# EAGLE design ReSpeaker 2-Mics Pi HAT (EAGLE 8.1.0)
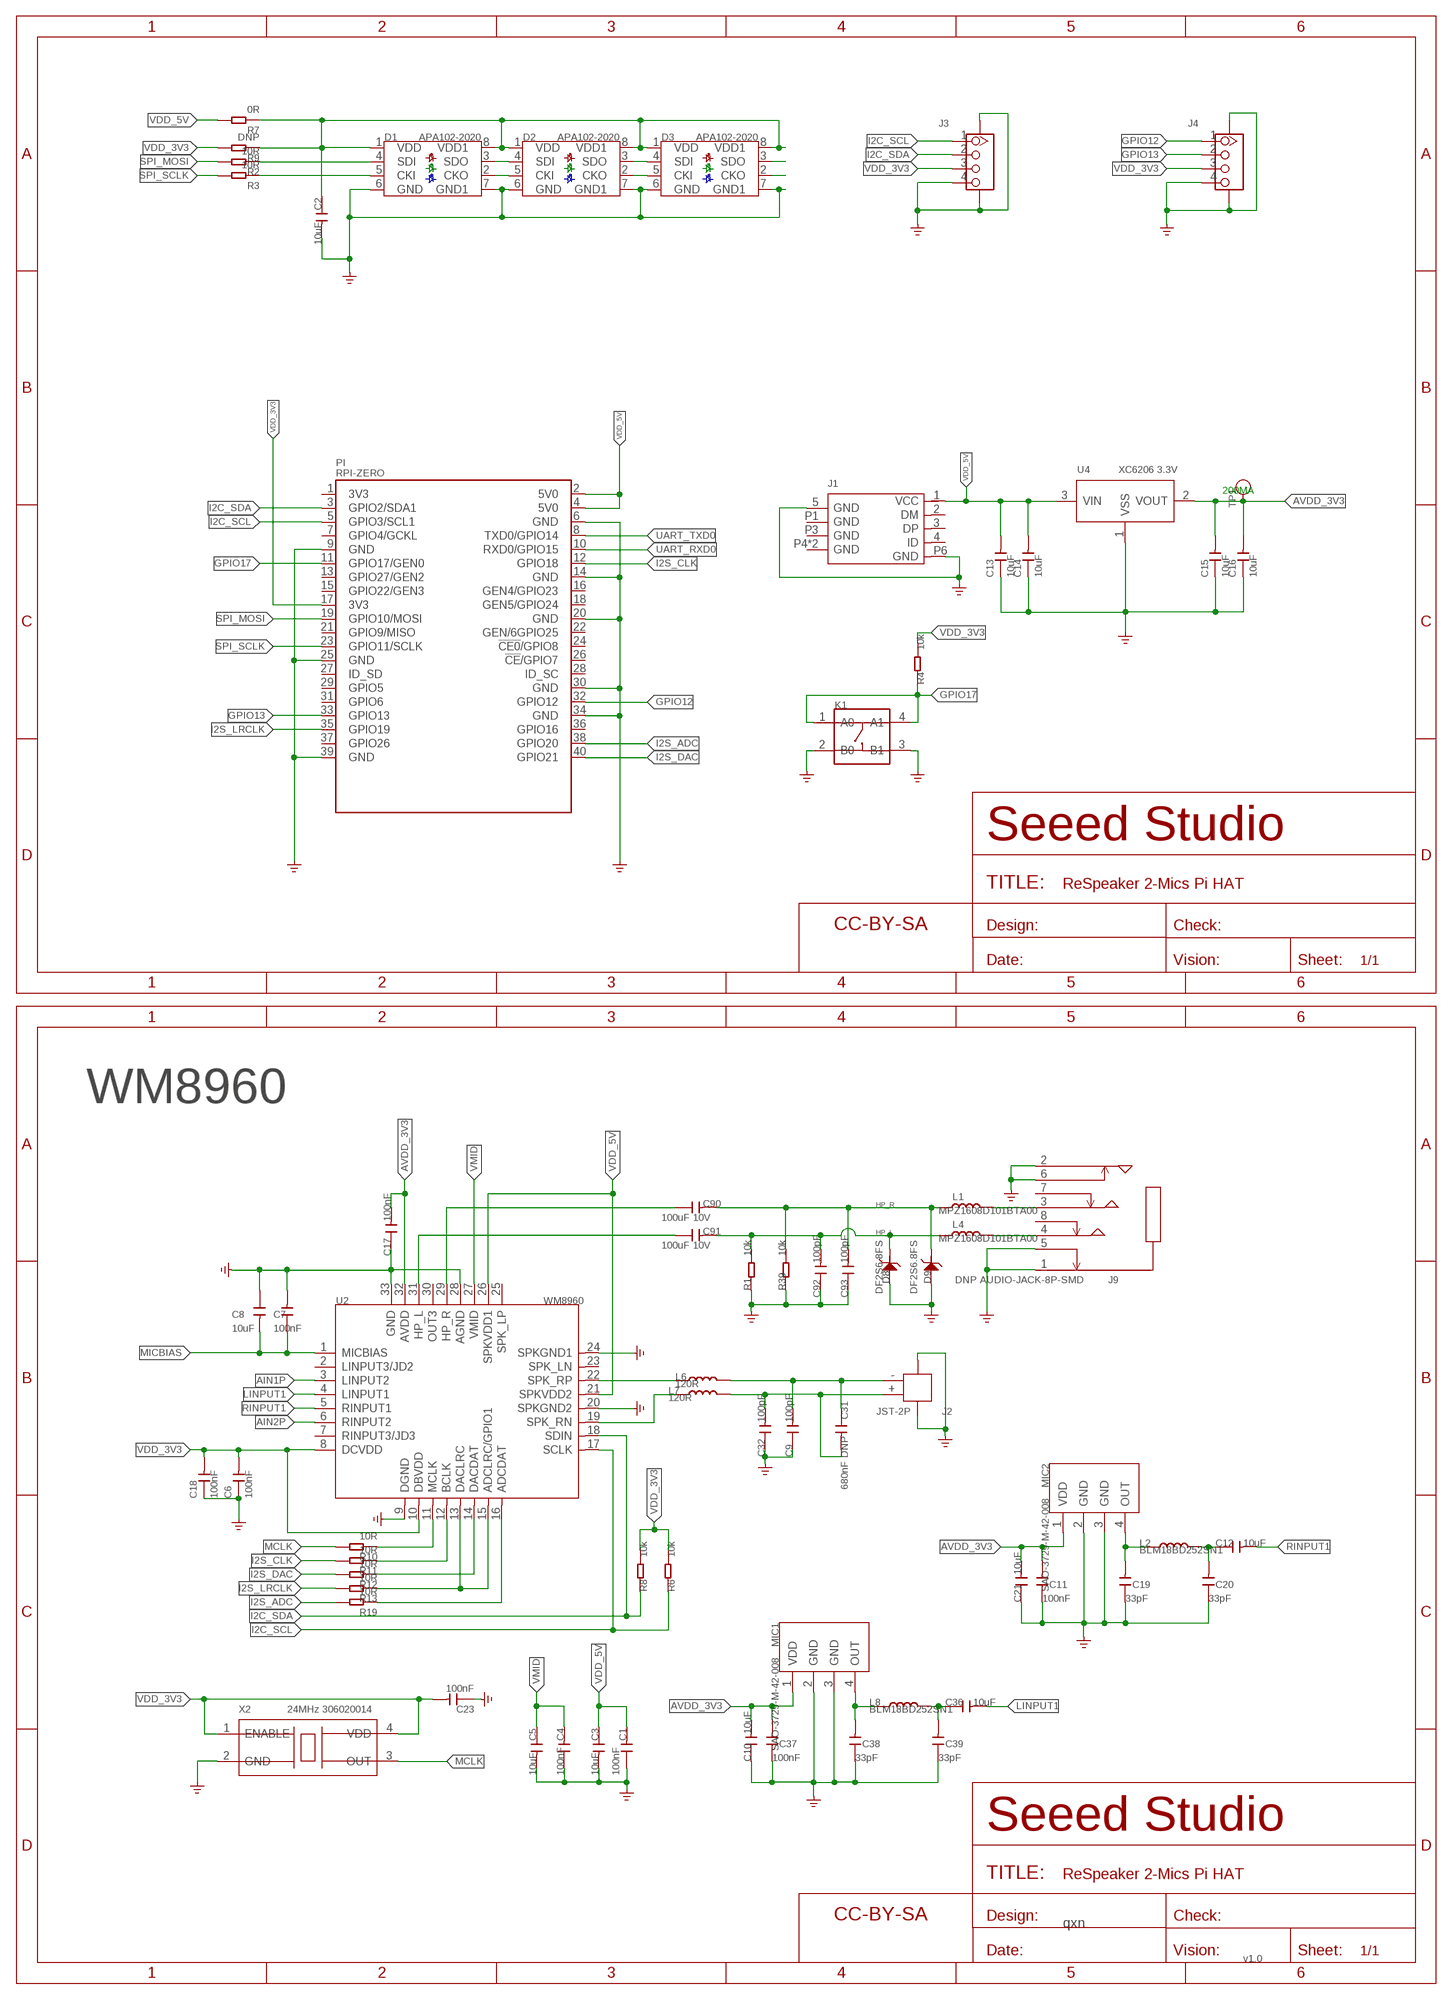
[diagram p0: schematic, sheet 1]

## Parts
C1  100nF  CAP-0402  [C0402]
C2  10uF  CAP-0603  [C0603]
C3  10uF  CAP-0603  [C0603]
C4  100nF  CAP-0402  [C0402]
C5  10uF  CAP-0603  [C0603]
C6  100nF  CAP-0402  [C0402]
C7  100nF  CAP-0402  [C0402]
C8  10uF  CAP-0603  [C0603]
C9  100pF  CAP-0402  [C0402]
C10  10uF  CAP-0603  [C0603]
C11  100nF  CAP-0402  [C0402]
C12  10uF  CAP-0603  [C0603]
C13  10uF  CAP-0603  [C0603]
C14  10uF  CAP-0603  [C0603]
C15  10uF  CAP-0603  [C0603]
C16  10uF  CAP-0603  [C0603]
C17  100nF  CAP-0402  [C0402]
C18  100nF  CAP-0402  [C0402]
C19  33pF  CAP-0402  [C0402]
C20  33pF  CAP-0402  [C0402]
C21  10uF  CAP-0603  [C0603]
C23  100nF  CAP-0402  [C0402]
C31  680nF DNP  CAP-0402  [C0402]
C32  100pF  CAP-0402  [C0402]
C36  10uF  CAP-0603  [C0603]
C37  100nF  CAP-0402  [C0402]
C38  33pF  CAP-0402  [C0402]
C39  33pF  CAP-0402  [C0402]
C90  100uF 10V  CAP-0805  [C0805]
C91  100uF 10V  CAP-0805  [C0805]
C92  100pF  CAP-0402  [C0402]
C93  100pF  CAP-0402  [C0402]
D1  APA102-2020  LED-RGB-8P-APA102-2020  [RGB2020]
D2  APA102-2020  LED-RGB-8P-APA102-2020  [RGB2020]
D3  APA102-2020  LED-RGB-8P-APA102-2020  [RGB2020]
D8  DF2S6.8FS  D-ESD-2P'DF2S6.8FS'  [SOD-923]
D9  DF2S6.8FS  D-ESD-2P'DF2S6.8FS'  [SOD-923]
FR1  SEEEDSTUDIO-OPEN-SCH-FRAME  [SEEEDSTUDIO-PCB-FRAME]
FR8  SEEEDSTUDIO-OPEN-SCH-FRAME  [SEEEDSTUDIO-PCB-FRAME]
J1  MICRO-USB5+4P  [MICRO-USB5+5P-SMD-0.65-7.2X5.06MM]
J2  JST-2P  JST-2P-SMD'2.0'  [HW2-SMD-2.0-90D]
J3  GROVE-CONNECTOR-SMD'90D'  [HW4-SMD-2.0-90D]
J4  GROVE-CONNECTOR-SMD'90D'  [HW4-SMD-2.0-90D]
J9  DNP AUDIO-JACK-8P-SMD  AUDIO-JACK-8P-SMD'PJ-393'  [AUDIO8P-SMD-3.5-14.5X6.1X4.0MM]
K1  BUTTON-4PDTSM-62K-S-V-T/R(SN431)  [SW4-SMD-6.0X6.0X5.0MM]
L1  MPZ1608D101BTA00  INDUCTOR/FERRITE-BEAD'0603'  [L0603]
L2  BLM18BD252SN1  INDUCTOR/FERRITE-BEAD'0603'  [L0603]
L4  MPZ1608D101BTA00  INDUCTOR/FERRITE-BEAD'0603'  [L0603]
L6  120R  INDUCTOR/FERRITE-BEAD'0603'  [L0603]
L7  120R  INDUCTOR/FERRITE-BEAD'0603'  [L0603]
L8  BLM18BD252SN1  INDUCTOR/FERRITE-BEAD'0603'  [L0603]
MIC1  SAO-3729-M-42-008  MIC-MSM421A3729H8-C  [MIC4-SMD-3.76X2.95MM]
MIC2  SAO-3729-M-42-008  MIC-MSM421A3729H8-C  [MIC4-SMD-3.76X2.95MM]
PI  RPI-ZERO  [RASPBERRYPI_BASTELSTUBE_V13_RASPI_BOARD_B+_FULL]
R1  10k  RES-0402  [R0402]
R2  10R  RES-0402  [R0402]
R3  10R  RES-0402  [R0402]
R4  10k  RES-0402  [R0402]
R6  10k  RES-0402  [R0402]
R7  0R  RES-0402  [R0402]
R8  10k  RES-0402  [R0402]
R9  DNP  RES-0402  [R0402]
R10  10R  RES-0402  [R0402]
R11  10R  RES-0402  [R0402]
R12  10R  RES-0402  [R0402]
R13  10R  RES-0402  [R0402]
R19  10R  RES-0402  [R0402]
R39  10k  RES-0402  [R0402]
TP1  TEST-POINT-D65/35  [TP-D65/35MIL]
U2  WM8960  AMPLIFIER-WM8960  [QFN32G-0.5-5X5MM]
U4  XC6206 3.3V  PMIC-XC6206PMR  [SOT-23]
X2  24MHz 306020014  CRYSTAL-OSCILLATOR2.5*2.0  [OSC4-SMD-2.5X2.0X0.8MM]

## Nets
$123: C90.1 U2.29(HP_R)
$124: C91.1 U2.31(HP_L)
AIN1P: U2.3(LINPUT2)
AIN2P: U2.6(RINPUT2)
AVDD_3V3: C10.2 C11.2 C15.2 C16.2 C17.2 C21.2 C37.2 MIC1.1(VDD) MIC2.1(VDD) TP1.P1(T) U2.32(AVDD) U4.2(VOUT)
GND: C1.1 C2.2 C3.2 C4.1 C5.2 C6.1 C7.2 C8.1 C9.1 C10.1 C11.1 C13.1 C14.1 C15.1 C16.1 C17.1 C18.1 C19.1 C20.1 C21.1 C23.1 C32.1 C37.1 C38.1 C39.1 C92.1 C93.1 D1.6(GND) D1.7(GND1) D2.6(GND) D2.7(GND1) D3.6(GND) D3.7(GND1) D8.2 D9.2 J1.5(GND) J1.P6(GND) J2.3 J2.4 J3.4 J3.SS1 J3.SS2 J4.4 J4.SS1 J4.SS2 J9.1 J9.2 J9.5 J9.6 K1.2(B0) K1.3(B1) MIC1.2(GND) MIC1.3(GND) MIC2.2(GND) MIC2.3(GND) PI.6(GND) PI.9(GND) PI.14(GND) PI.20(GND) PI.25(GND) PI.30(GND) PI.34(GND) PI.39(GND) R1.1 R39.1 U2.9(DGND) U2.20(SPKGND2) U2.24(SPKGND1) U2.28(AGND) U2.33(GND) U4.1(VSS) X2.2(GND) ; supply symbol labelled GND_POWER
GPIO12: J4.1 PI.32(GPIO12)
GPIO13: J4.2 PI.33(GPIO13)
GPIO17: K1.1(A0) K1.4(A1) PI.11(GPIO17/GEN0) R4.1
HP_L: C91.2 C92.2 D8.1 L4.1 R1.2
HP_R: C90.2 C93.2 D9.1 L1.1 R39.2
I2C_SCL: J3.1 PI.5(GPIO3/SCL1) R6.1 U2.17(SCLK)
I2C_SDA: J3.2 PI.3(GPIO2/SDA1) R8.1 U2.18(SDIN)
I2S_ADC: PI.38(GPIO20) R19.2
I2S_CLK: PI.12(GPIO18) R11.2
I2S_DAC: PI.40(GPIO21) R12.2
I2S_LRCLK: PI.35(GPIO19) R13.2
LINPUT1: C36.2 U2.4(LINPUT1)
MCLK: R10.2 X2.3(OUT)
MICBIAS: C7.1 C8.2 U2.1(MICBIAS)
N$1: D1.2(CKO) D2.5(CKI)
N$2: D1.4(SDI) R2.1
N$3: C12.1 C20.2 L2.2
N$4: D1.3(SDO) D2.4(SDI)
N$5: D1.5(CKI) R3.1
N$6: C38.2 L8.1 MIC1.4(OUT)
N$7: C19.2 L2.1 MIC2.4(OUT)
N$8: D2.2(CKO) D3.5(CKI)
N$9: L6.1 U2.22(SPK_RP)
N$10: R12.1 U2.14(DACDAT)
N$11: D2.3(SDO) D3.4(SDI)
N$12: L7.1 U2.19(SPK_RN)
N$14: J9.3 L1.2
N$15: D3.2(CKO)
N$19: D3.3(SDO)
N$24: C36.1 C39.2 L8.2
N$34: R19.1 U2.16(ADCDAT)
N$35: R13.1 U2.13(DACLRC) U2.15(ADCLRC/GPIO1)
N$36: R11.1 U2.12(BCLK)
N$37: R10.1 U2.11(MCLK)
N$40: C9.2 C31.1 J2.- L6.2
N$47: C31.2 C32.2 J2.+ L7.2
N$57: J9.4 L4.2
RINPUT1: C12.2 U2.5(RINPUT1)
SPI_MOSI: PI.19(GPIO10/MOSI) R2.2
SPI_SCLK: PI.23(GPIO11/SCLK) R3.2
UART_RXD0: PI.10(RXD0/GPIO15)
UART_TXD0: PI.8(TXD0/GPIO14)
VDD_3V3: C6.2 C18.2 C23.2 J3.3 J4.3 PI.17(3V3) R4.2 R6.2 R8.2 R9.2 U2.8(DCVDD) U2.10(DBVDD) X2.1(ENABLE) X2.4(VDD)
VDD_5V: C1.2 C3.1 C13.2 C14.2 J1.1(VCC) PI.2(5V0) PI.4(5V0) R7.2 U2.21(SPKVDD2) U2.26(SPKVDD1) U4.3(VIN)
VDD_LED: C2.1 D1.1(VDD) D1.8(VDD1) D2.1(VDD) D2.8(VDD1) D3.1(VDD) D3.8(VDD1) R7.1 R9.1
VMID: C4.2 C5.1 U2.27(VMID)
Unconnected: J1.2(DM) J1.3(DP) J1.4(ID) J1.P1(GND) J1.P3(GND) J1.P4(GND) J1.P5(GND) J9.7 J9.8 PI.1(3V3) PI.7(GPIO4/GCKL) PI.13(GPIO27/GEN2) PI.15(GPIO22/GEN3) PI.16(GEN4/GPIO23) PI.18(GEN5/GPIO24) PI.21(GPIO9/MISO) PI.22(GEN/6GPIO25) PI.24(!CE0!/GPIO8) PI.26(!CE!/GPIO7) PI.27(ID_SD) PI.28(ID_SC) PI.29(GPIO5) PI.31(GPIO6) PI.36(GPIO16) PI.37(GPIO26) U2.2(LINPUT3/JD2) U2.7(RINPUT3/JD3) U2.23(SPK_LN) U2.25(SPK_LP) U2.30(OUT3)

## Notes on the sheet
- 200MA
- WM8960
- qxn
- v1.0

## Library data of the parts
C1-C21 C23 C31 C32 C36-C39 C90-C93 = Discrete-new:CAP: Ceramic Capacitors
D1-D3 = Discrete-new:LED-RGB-8P-APA102-2020
D8 D9 = Discrete-new:D-ESD-2P: SOD-923:304060009;SOD-123:304060001
FR1 FR8 = moudle-new:SEEEDSTUDIO-OPEN-SCH-FRAME
J1 = Connector-new:MICRO-USB5+4P: 5+4P-SMD-0.65-B:320010000;5+2P-SMD-0.65-AB:340032001;5+5P-SMD-0.65-7.2X5.06MM:320010050;
J2 = Connector-new:JST-2P-SMD: 2P-SMD-1.0-90D:320110054;2P-SMD-2.0-90D:320110026
J3 J4 = Connector-new:GROVE-CONNECTOR-SMD: 4P-SMD-2.0:320110030;4P-SMD-2.0-90D:320110032
J9 = Connector-new:AUDIO-JACK-8P-SMD: 320040009
K1 = Discrete-new:BUTTON-4P: SW4-6.0X6.0X5.0MM:311020024;SW4-8.0X8.0X9.0MM:311020028;SW4-SMD-6.0X6.0X5.0MM:311020004;SW4-SMD-3.35X3.35X1.5MM:311020030;SW4-SMD-5.2X5.2X2.5MM:311020046
L1 L2 L4 L6-L8 = Discrete-new:INDUCTOR/FERRITE-BEAD
MIC1 MIC2 = Connector-new:MIC-MSM421A3729H8-C
PI = RPI-Zero:RPI-ZERO
R1 R4 R6 R8 R39 = Discrete-new:RES
R2 R3 R7 R9-R13 R19 = C-R-package test:RES
TP1 = Discrete-new:TEST-POINT
U2 = IC-new:AMPLIFIER-WM8960
U4 = IC-new:PMIC-XC6206P: LOW ESR Cap.Compatible Positive Voltage Regulators
X2 = Discrete-new:CRYSTAL-OSCILLATOR

## Board
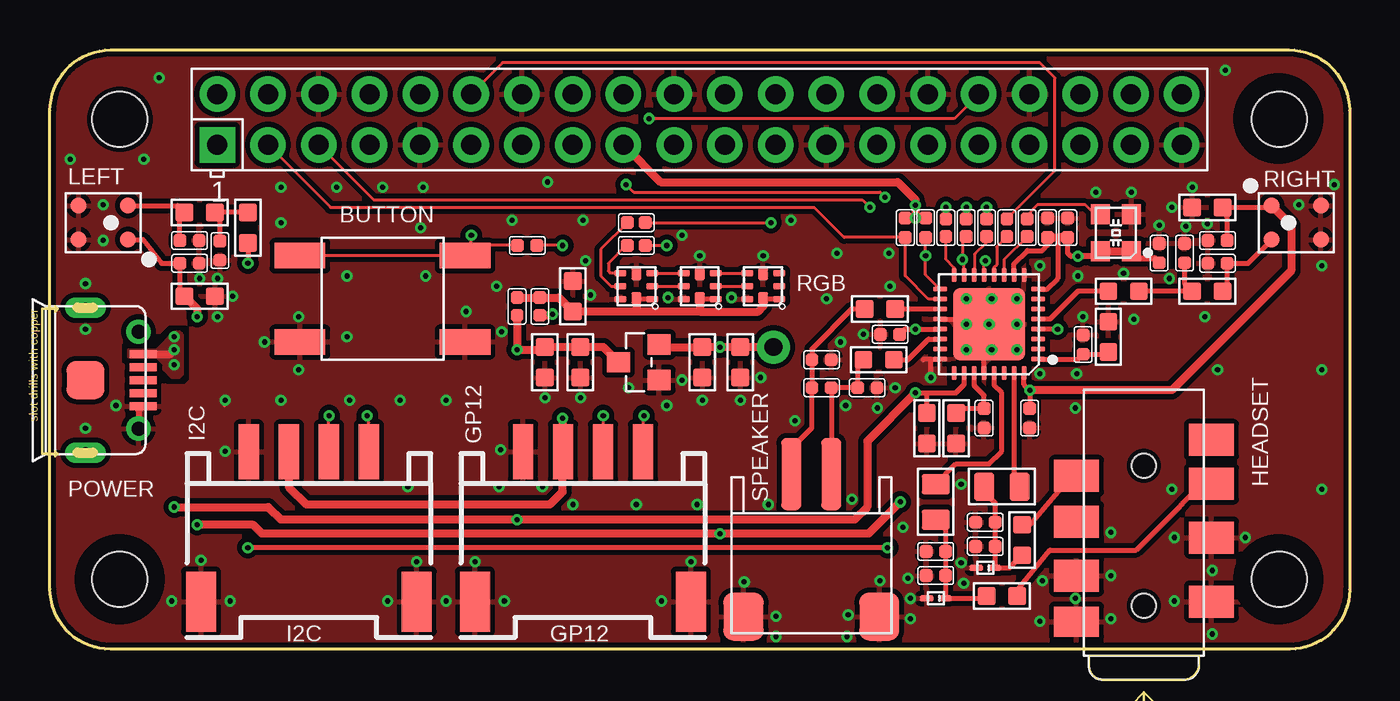
[diagram p1: board, top side]
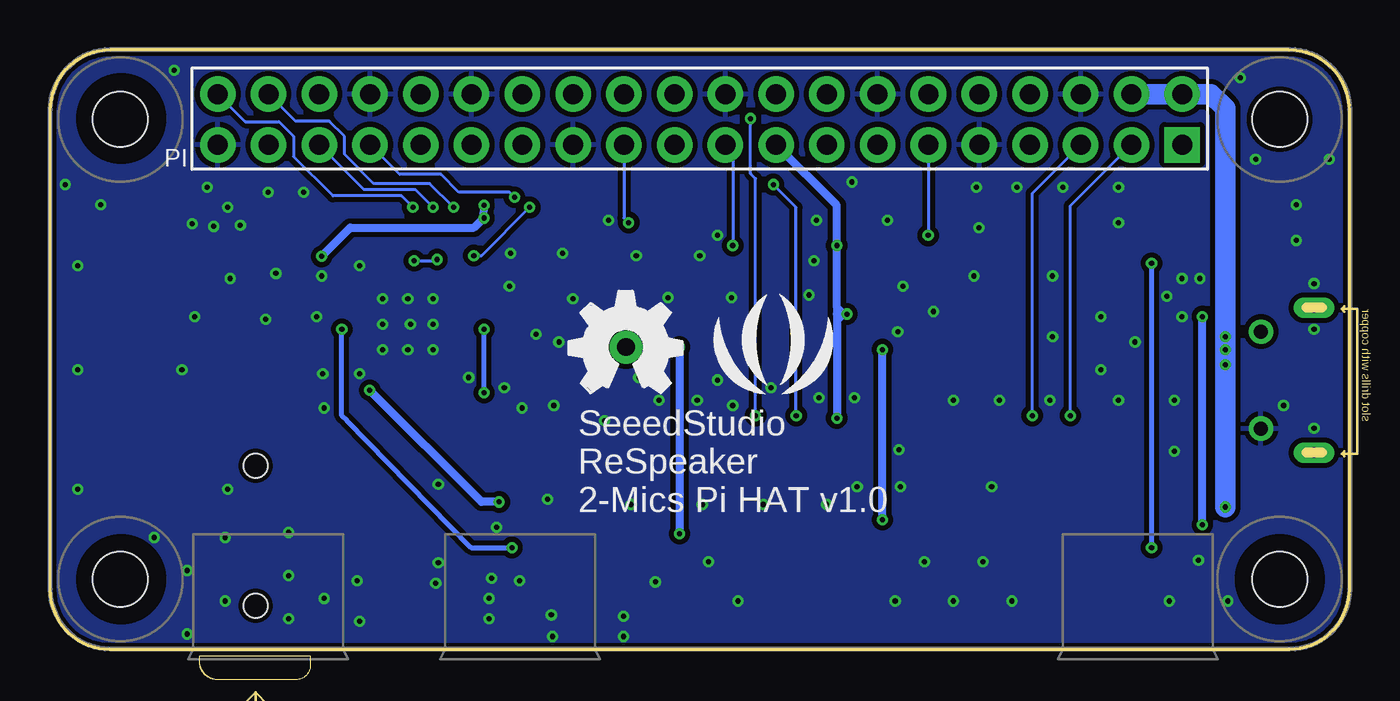
[diagram p2: board, bottom side, seen from below]

Size 65.02 x 29.97 mm. Coordinates in mm from the lower left corner, seen from the top.
Outline: 3.03,29.97 62,29.97 arc-90 65.02,26.95 65.02,2.98 arc-90 62.04,0 3.02,0 arc-90 0,3.02 0,26.94 arc-90 3.03,29.97
Copper layers (1*16): Top 0.035mm / dielectric 1.5mm / Bottom 0.035mm
Design rules "SeeedStudio_2layer_DRU_no_angle_20140221 *": minimum track width 6mil, minimum drill 10mil, track to track 6mil, track to pad 6mil, pad to pad 6mil, via to via 6mil, smd to smd 0mil, copper to edge 10mil, drill to drill 10mil, minimum pad ring 10mil, minimum via ring 6mil, stop-mask expansion 2mil, vias tented up to drill 25mil, thermal gap 10mil
tRestrict: area 59.5,24.5 to 63.5,28.5; area 59.5,1.5 to 63.5,5.5; area 1.5,1.5 to 5.5,5.5
bRestrict: area 59.5,24.5 to 63.5,28.5; area 59.5,1.5 to 63.5,5.5; area 1.5,1.5 to 5.5,5.5

### Footprints (pad centres in the part's own frame; a part is rotated, then mirrored left to right if it is on the bottom)
C0402 = smd 0.635 x 0.635: 1 0,0.484; 2 0,-0.484
C0603 = smd 0.889 x 0.889: 1 0,0.762; 2 0,-0.762
C0805 = smd 1.397 x 1.016: 1 0,0.889; 2 0,-0.889
RGB2020 = smd 0.6 x 0.3: 1 -0.8,0.65; 2 -0.8,0; 3 -0.8,-0.65; 4 0.8,-0.65; 5 0.8,0; 6 0.8,0.65 | smd 0.5 x 0.6: 7 0,-0.6; 8 0,0.6
SOD-923 = smd 0.7 x 0.3: 1 -0.45,0; 2 0.45,0
MICRO-USB5+5P-SMD-0.65-7.2X5.06MM = smd 0.4 x 1.35: 1 -1.3,2.875; 2 -0.65,2.875; 3 0,2.875; 4 0.65,2.875; 5 1.3,2.875 | smd 1.9 x 1.9: P1 0,0 | drill 0.508 pad 1.016 long: P3 -3.625,0; P4 3.625,0 | drill 0.7: P5 -2.425,2.65; P6 2.425,2.65
HW2-SMD-2.0-90D = smd 2 x 2.4: 3 3.4,-2.181; 4 -3.4,-2.181 | smd 1 x 3.6: + -1,4.953; - 1,4.953
HW4-SMD-2.0-90D = smd 1.01 x 2.74: 1 -3,-0.1; 2 -1,-0.1; 3 1,-0.1; 4 3,-0.1 | smd 1.5 x 3: SS1 -5.4,7.4; SS2 5.4,7.4
AUDIO8P-SMD-3.5-14.5X6.1X4.0MM = smd 1.6 x 2.25: 1 3.9,-3.375; 2 7.1,-3.375; 3 9.8,-3.375; 4 10.2,3.375; 6 5.2,3.375; 7 7.9,3.375; 8 12,-3.375 | smd 1.5 x 2.25: 5 2.9,3.375 | hole 1.2: 3.7,0; 10.7,0
SW4-SMD-6.0X6.0X5.0MM = smd 2.54 x 1.27: 1 -4.129,2.159; 2 -4.129,-2.159; 3 4.129,-2.159; 4 4.129,2.159
L0603 = smd 0.889 x 0.889: 1 -0.762,0; 2 0.762,0
MIC4-SMD-3.76X2.95MM = smd 0.8 x 0.8: 1 0.85,1.23; 2 0.85,-1.23; 3 -0.85,-1.23; 4 -0.85,1.23
RASPBERRYPI_BASTELSTUBE_V13_RASPI_BOARD_B+_FULL = drill 1 pad 1.778 square: 1 8.37,25.23 | drill 1 pad 1.778: 2 8.37,27.77; 3 10.91,25.23; 4 10.91,27.77; 5 13.45,25.23; 6 13.45,27.77; 7 15.99,25.23; 8 15.99,27.77; 9 18.53,25.23; 10 18.53,27.77; 11 21.07,25.23; 12 21.07,27.77; 13 23.61,25.23; 14 23.61,27.77; 15 26.15,25.23; 16 26.15,27.77; 17 28.69,25.23; 18 28.69,27.77; 19 31.23,25.23; 20 31.23,27.77; 21 33.77,25.23; 22 33.77,27.77; 23 36.31,25.23; 24 36.31,27.77; 25 38.85,25.23; 26 38.85,27.77; 27 41.39,25.23; 28 41.39,27.77; 29 43.93,25.23; 30 43.93,27.77; 31 46.47,25.23; 32 46.47,27.77; 33 49.01,25.23; 34 49.01,27.77; 35 51.55,25.23; 36 51.55,27.77; 37 54.09,25.23; 38 54.09,27.77; 39 56.63,25.23; 40 56.63,27.77 | hole 2.75: 3.5,3.5; 3.5,26.5; 61.5,3.5; 61.5,26.5
R0402 = smd 0.635 x 0.635: 1 0,0.484; 2 0,-0.484
R0402' = smd 0.635 x 0.635: 1 0,0.445; 2 0,-0.445
TP-D65/35MIL = drill 0.889 pad 1.651: P1 0,0
QFN32G-0.5-5X5MM = smd 0.7 x 0.25: 1 -2.45,1.75; 2 -2.45,1.25; 3 -2.45,0.75; 4 -2.45,0.25; 5 -2.45,-0.25; 6 -2.45,-0.75; 7 -2.45,-1.25; 8 -2.45,-1.75; 17 2.45,-1.75; 18 2.45,-1.25; 19 2.45,-0.75; 20 2.45,-0.25; 21 2.45,0.25; 22 2.45,0.75; 23 2.45,1.25; 24 2.45,1.75 | smd 0.25 x 0.7: 9 -1.75,-2.45; 10 -1.25,-2.45; 11 -0.75,-2.45; 12 -0.25,-2.45; 13 0.25,-2.45; 14 0.75,-2.45; 15 1.25,-2.45; 16 1.75,-2.45; 25 1.75,2.45; 26 1.25,2.45; 27 0.75,2.45; 28 0.25,2.45; 29 -0.25,2.45; 30 -0.75,2.45; 31 -1.25,2.45; 32 -1.75,2.45 | smd 3.6 x 3.6: 33 0,0
SOT-23 = smd 1.016 x 1.143: 1 -0.889,-1.016; 2 0.889,-1.016; 3 0,1.016
OSC4-SMD-2.5X2.0X0.8MM = smd 1 x 0.95: 1 -0.925,-0.775; 2 0.925,-0.775; 3 0.925,0.775; 4 -0.925,0.775

### Placement (x,y rotation side)
C1  42.04,15.75 90 top
C2  26.16,17.65 180 top
C3  43.88,11.05 0 top
C4  46.74,11.56 180 top
C5  45.34,11.05 0 top
C6  50.93,21.08 0 top
C7  51.69,15.24 180 top
C8  52.96,15.62 0 top
C9  40.89,13.08 270 top
C10  7.49,17.65 270 top
C11  58.42,20.45 90 top
C12  53.72,17.91 270 top
C13  24.77,14.35 180 top
C14  26.54,14.35 180 top
C15  34.54,14.35 180 top
C16  32.64,14.35 180 top
C17  49.02,11.56 180 top
C18  49.91,21.08 0 top
C19  58.42,19.3 90 top
C20  56.77,19.81 0 top
C21  57.91,22.1 90 top
C23  55.5,19.81 0 top
C31  38.61,13.08 270 top
C32  38.61,14.48 270 top
C36  9.91,21.08 0 top
C37  6.98,19.3 270 top
C38  6.98,20.45 270 top
C39  8.51,19.94 180 top
C90  44.32,7.37 0 top
C91  47.62,8.13 270 top
C92  46.8,6.35 90 top
C93  44.32,4.89 90 top
D1  29.34,18.16 180 top
D2  32.51,18.16 180 top
D3  35.69,18.16 180 top
D8  46.8,4.06 180 top
D9  44.32,2.54 180 top
FR1  -1.02,-13.46 0 top  (outside the outline)
FR8  -1.02,-13.46 0 top  (outside the outline)
J1  1.78,13.46 270 top
J2  38.1,3.81 0 top
J3  12.95,9.78 180 top
J4  26.67,9.78 180 top
J9  54.74,-1.52 90 top
K1  16.64,17.53 0 top
L1  47.62,2.67 0 top
L2  57.91,17.91 180 top
L4  48.64,5.46 90 top
L6  41.47,14.48 180 top
L7  41.53,17.02 180 top
L8  7.49,21.84 0 top
MIC1  2.67,21.34 270 top
MIC2  62.36,21.34 90 top
PI  0,0 0 top
R1  46.8,5.14 90 top
R2  10R  [R0402']  29.34,20.19 90 top
R3  10R  [R0402']  29.34,21.34 90 top
R4  23.88,20.19 90 top
R6  43.81,21.08 180 top
R7  0R  [R0402']  23.37,17.15 0 top
R8  42.8,21.08 180 top
R9  DNP  [R0402']  24.51,17.15 0 top
R10  10R  [R0402']  48.89,21.08 180 top
R11  10R  [R0402']  47.88,21.08 180 top
R12  10R  [R0402']  46.86,21.08 180 top
R13  10R  [R0402']  45.85,21.08 180 top
R19  10R  [R0402']  44.83,21.08 180 top
R39  44.32,3.68 90 top
TP1  36.19,15.11 0 top
U2  46.99,16.26 180 top
U4  29.46,14.35 90 top
U$13  [SEEED-SILK-280*268MIL]  28.83,14.48 0 bottom
U$22  [OSHW_FILLX200_NOTEXT_TNAME]  39.05,12.83 0 bottom
X2  53.34,20.83 90 top

### Tracks (layer width: path | path; a pad name or v marks a point on that pad's centre or on a via)
$123
  Top 0.254: U2.29 47.24,13.21 47.62,12.83 47.62,9.91 46.99,9.27 45.34,9.27 C90.1
$124
  Top 0.254: U2.31 48.24,8.4 C91.1
AVDD_3V3  (via drill 0.25 pad 0.51)
  Top 0.152: 33.65,15.11 v33.53,15.11
  Top 0.254: C17.2 v49.02,12.95 48.74,13.24 U2.32 | C11.2 58.9,21.61 C21.2 61.04,22.1 MIC2.1 | MIC1.1 4.66,20.49 5.59,19.3 C37.2 6.5,17.88 C10.2
  Top 0.406: v33.53,15.11 C16.2 30.61,15.11 U4.2 | 33.65,15.11 C15.2 TP1.P1 | v42.54,7.37 40.96,5.78 v33.53,5.78 10.61,5.78 10.17,6.22 v7.37,6.22 | MIC2.1 62.1,21.21 62.1,18.92 56.13,12.95 v49.02,12.95 | C10.2 7.37,17.02 v7.37,16.64
  Bottom 0.406: v33.53,15.11 v33.53,5.78 | v42.54,7.37 43.43,7.37 v49.02,12.95 | v7.37,6.22 v7.37,16.64
GND  (via drill 0.25 pad 0.51)
  Top 0.152: 8.73,12.16 8.76,12.19
  Top 0.254: 43.69,14.48 43.72,14.51 44.07,14.51 | U2.28 46.74,14.61 v47.12,14.99 | U2.20 45.6,16.51 v45.85,16.26 | 44.07,14.51 U2.24 | v44.07,13.59 44.07,14.51
  Top 0.305: J1.5 4.43,11.94 J1.P6
  other vias: 8.76,12.45 3.3,12.19 8.76,9.91 22.54,9.97 19.81,12.45 24.77,12.57 26.54,12.57 28.96,13.08 31.62,13.46 32.51,19.69 35.69,19.69 35.56,13.59 34.54,12.45 32.64,12.45 41.4,12.06 42.29,13.08 45.85,17.53 47.12,17.53 48.39,17.53 48.39,14.99 45.85,14.99 48.39,16.26 46.99,16.26 49.53,19.18 51.69,16.64 54.23,16.51 63.63,19.18 64.26,23.24 62.48,22.23 57.15,23.11 56.13,22.1 54.1,22.86 57.78,16.64 55.5,21.21 56.26,5.59 56.26,2.41 58.17,0.76 58.17,3.94 59.82,5.59 53.09,3.68 51.31,2.54 53.09,1.52 49.53,1.4 49.66,3.43 45.72,3.3 45.59,4.32 45.59,8.25 42.67,6.1 42.93,3.56 43.05,2.54 43.05,1.52 30.61,2.41 22.73,2.41 19.81,2.41 16.89,2.41 9.02,2.41 6.1,2.41 1.78,11.05 1.78,16 1.78,18.29 2.67,20.45 2.67,22.23 1.02,24.51 9.14,17.65 8.38,16.64 7.49,18.54 8.38,18.54 11.56,12.45 26.16,7.24 32.38,7.24 35.94,7.24 30.86,12.19 30.92,17.59 34.1,17.59 27.05,17.72 26.8,19.43 26.67,21.46 31.62,20.7 37.08,21.46 40.13,7.49 39.81,12.19 40.7,15.75 39.56,15.37 57.91,21.27 56.83,21.15 5.46,28.58 18.67,23.11 24.89,23.37 18.54,21.08 22.35,18.16 22.61,15.88 14.86,15.62 12.45,16.64 12.45,13.97 14.99,12.45 63.63,8 63.63,13.97 58.8,28.96 52.32,22.86 58.42,13.97 49.53,13.78 53.09,5.84 56.13,8 39.88,0.64 36.32,0.64 17.91,8.13 22.48,8.13 17.53,12.45 4.7,24.51 18.8,18.67 20.83,16.89 10.73,15.37 56.01,18.54 51.43,18.67 53.72,18.8 37.27,11.43 41.97,19.81 42.04,18.16 39.37,19.81 38.86,17.53 29.34,7.24 24.64,8.13 16.64,23.11 14.35,23.11 11.56,23.11 11.56,21.34 14.86,18.67 23.11,21.46 51.37,13.78 51.31,12.06 18.35,4.38 21.27,4.38 32.07,4.38 7.56,4.45 34.73,3.37 39.94,1.71 36.32,1.65 41.53,3.43
  pour Top: -25.27,23.24 -25.27,21.34 -22.73,21.34 -22.73,23.24
  pour Top (isolate 0.254, rank 4): 0,0 65.53,0 66.8,0 66.8,30.23 0,30.23
  pour Bottom (isolate 0.254, rank 4): -0.13,0 65.41,0 66.67,0 66.67,30.23 -0.13,30.23
GPIO12  (via drill 0.25 pad 0.51)
  Top 0.152: PI.32 45.24,26.54 v29.97,26.54 | v29.72,11.68 29.67,11.64 J4.1
  Bottom 0.152: v29.72,11.68 29.72,23.53 29.97,23.79 v29.97,26.54
GPIO13  (via drill 0.25 pad 0.51)
  Top 0.152: v27.69,11.68 27.67,11.67 J4.2 | v41.78,22.61 41.53,22.86 29.21,22.86 v28.83,23.24
  Bottom 0.152: PI.33 47.53,23.75 45.47,23.75 44.58,22.86 42.04,22.86 v41.78,22.61 | v27.69,11.68 27.69,22.1 v28.83,23.24
GPIO17  (via drill 0.25 pad 0.51)
  Top 0.152: K1.4 K1.1 | 21.08,20 arc-90 K1.4 | 21.08,20 v21.08,20.7 | 20.87,19.58 K1.4 | R4.1 21.27,20.19 21.08,20
  Bottom 0.152: PI.11 21.07,20.7 v21.08,20.7
HP_L
  Top 0.254: C91.2 46.74,7.87 46.86,7.75 46.99,7.62 47.28,7.33 C92.2 R1.2 47.28,4.1 D8.1 48.01,4.06 L4.1
HP_R
  Top 0.254: C90.2 44.81,5.99 C93.2 R39.2 44.81,2.57 D9.1 46.74,2.54 L1.1
I2C_SCL  (via drill 0.25 pad 0.51)
  Top 0.152: J3.1 15.95,11.35 15.94,11.37 15.94,11.62 v15.88,11.68 | U2.17 43.81,18.73 v43.81,19.69 R6.1 | PI.5 16.2,22.48 40.64,22.48 v41.02,22.1
  Bottom 0.152: v15.88,11.68 15.88,22.8 PI.5 | v43.81,19.69 43.43,19.69 v41.02,22.1
I2C_SDA  (via drill 0.25 pad 0.51)
  Top 0.152: U2.18 43.96,17.51 42.8,18.67 R8.1 39.73,20.6 38.23,22.1 14.04,22.1 PI.3 | J3.2 13.95,11.67
  Top 0.254: v13.97,11.68 13.95,11.67
  Bottom 0.152: v13.97,11.68 13.97,22.17 PI.3
I2S_ADC  (via drill 0.25 pad 0.51)
  Top 0.152: R19.2 v44.83,22.1
  Bottom 0.152: PI.38 52.74,26.42 51.05,26.42 50.29,25.65 50.29,24.77 48.82,23.29 46.02,23.29 v44.83,22.1
I2S_CLK
  Top 0.152: PI.12 22.64,29.34 49.53,29.34 50.29,28.58 50.29,23.94 R11.2
I2S_DAC  (via drill 0.25 pad 0.51)
  Top 0.152: R12.2 v46.86,22.1
  Bottom 0.152: PI.40 55.24,26.38 53.56,26.38 52.83,25.65 52.83,24.64 50.86,22.67 47.43,22.67 v46.86,22.1
I2S_LRCLK  (via drill 0.25 pad 0.51)
  Top 0.152: R13.2 v45.85,22.1
  Bottom 0.152: PI.35 49.31,22.99 46.74,22.99 v45.85,22.1
LINPUT1  (via drill 0.25 pad 0.51)
  Top 0.254: C36.2 v9.91,19.3 | v50.42,16 U2.4 | v41.91,5.08 v9.91,5.08
  Bottom 0.254: v9.91,19.3 v9.91,5.08 | v41.91,5.08 43.94,5.08 50.16,11.43 50.42,11.68 v50.42,16
MCLK
  Top 0.152: R10.2 48.89,21.72 49.4,22.23 51.82,22.23 52.54,21.5 X2.3
MICBIAS
  Top 0.254: C8.2 52.73,14.76 C7.1 51.44,14.51 U2.1
N$1
  Top 0.152: D1.2 D2.5
N$2
  Top 0.152: D1.4 28.05,18.81 27.94,18.92 27.94,19.3 28.83,20.19 R2.1
N$3
  Top 0.254: C20.2 56.77,18.29 L2.2 C12.1
N$4
  Top 0.152: D1.3 D2.4
N$5
  Top 0.152: D1.5 28.07,18.16 27.56,18.67 27.56,20 R3.1
N$6
  Top 0.254: MIC1.4 6.39,22.19 L8.1 6.5,21.61 C38.2
N$7
  Top 0.254: L2.1 58.9,18.14 C19.2 59.94,19.3 MIC2.4
N$8
  Top 0.152: D2.2 D3.5
N$9
  Top 0.254: U2.22 43.95,15.51 42.93,14.48 L6.1
N$10
  Top 0.152: R12.1 46.86,20.34 46.29,19.77 46.29,18.76 U2.14
N$11
  Top 0.152: D2.3 D3.4
N$12
  Top 0.254: U2.19 42.3,17.01 L7.1
N$14
  Top 0.254: L1.2 48.39,2.92 50.04,4.95 54.36,4.95 56.51,7.11 56.64,7.24 57.68,8.28 J9.3
N$24
  Top 0.254: C39.2 8.51,21.59 L8.2 C36.1
N$34
  Top 0.152: U2.16 45.24,19.09 44.83,19.49 R19.1
N$35  (via drill 0.25 pad 0.51)
  Top 0.152: U2.13 46.74,19.37 v46.8,19.43 | U2.15 45.74,19.41 v45.66,19.49 45.66,20.45 R13.1
  Bottom 0.152: v46.8,19.43 45.72,19.43 v45.66,19.49
N$36
  Top 0.152: U2.12 47.24,19.11 47.37,19.24 47.37,20.13 R11.1
N$37
  Top 0.152: R10.1 47.74,19.48 U2.11
N$40
  Top 0.254: L6.2 40.41,14.18 C9.2 C31.1 J2.-
N$47
  Top 0.254: L7.2 40.13,17.02 38.12,15.01 C32.2 C31.2 38.12,11.07 37.1,10.05 J2.+
N$57
  Top 0.254: L4.2 49.02,6.22 51.09,8.68 J9.4
RINPUT1
  Top 0.254: U2.5 50.03,16.51 51.43,17.91 C12.2
SPI_MOSI  (via drill 0.25 pad 0.51)
  Top 0.152: R2.2 v30.86,20.19
  Bottom 0.152: PI.19 30.86,24.86 v30.86,20.19
SPI_SCLK  (via drill 0.25 pad 0.51)
  Top 0.152: R3.2 v36.07,21.34
  Bottom 0.152: v36.07,21.34 36.31,21.58 PI.23
VDD_3V3  (via drill 0.25 pad 0.51)
  Top 0.152: v25.65,20.19 R4.2
  Top 0.254: U2.8 49.88,18.01 50.42,18.54 50.42,20.6 | U2.10 48.24,19.28 48.89,19.94 49.66,19.94 49.91,20.19 C18.2 | v51.43,19.65 51.09,19.65 50.93,19.81 C6.2
  Top 0.305: X2.4 52.31,19.65 v51.43,19.65 | C23.2 55.27,19.56 54.46,19.56 X2.1
  Top 0.406: X2.4 X2.1 | C18.2 50.42,20.6 C6.2 | J3.3 11.95,8.11 12.83,7.24 25.02,7.24 25.65,7.87 25.65,9.86 J4.3 25.67,11.54 v25.65,11.56 | v43.31,21.57 R8.2 | v43.31,21.57 R6.2 | v43.31,21.57 v43.31,22.2 43.31,22.48 42.42,23.37 30.55,23.37 PI.17 | R9.2 25.15,16.7 v25.15,16.76
  Bottom 0.152: 25.65,17.15 25.53,17.15 v25.15,16.76 25.53,16.38
  Bottom 0.406: v51.43,19.65 50,21.08 43.81,21.08 43.33,21.57 v43.31,22.2 | 25.65,16.76 v25.65,11.56 | 25.65,16.76 25.65,17.15 v25.65,20.19 25.65,22.19 PI.17 | 25.65,16.76 v25.15,16.76
VDD_5V  (via drill 0.25 pad 0.51)
  Top 0.254: U2.26 45.74,13.23 45.34,12.83 43.94,12.83 | C1.2 42.78,16.01 v43.31,16.01 U2.21 | v43.31,12.83 43.94,12.83 | C3.1 43.88,12.76 43.94,12.83
  Top 0.406: C13.2 C14.2 27.69,15.11 U4.3 | J1.1 6,14.76 v6.22,14.99 | C13.2 24.64,14.99 v23.37,14.99 R7.2 | 24.64,15.24 C13.2 | v6.22,7.11 10.92,7.11 11.56,6.48 v23.37,6.48 40.26,6.48 40.89,7.11 40.89,10.41 v43.31,12.83
  Bottom 0.254: v43.31,12.83 v43.31,16.01
  Bottom 0.406: v23.37,6.48 v23.37,14.99
  Bottom 1.016: PI.4 PI.2 6.94,27.77 6.22,27.05 v6.22,14.99 v6.22,7.11
  other vias: 6.22,15.62 6.22,14.22
  pour Top (no thermals): 3.94,14.99 5.33,14.99 6.22,15.88 6.48,15.88 6.6,15.75 6.6,13.72 6.48,13.59 6.1,13.59 5.71,13.97 5.71,14.22 5.33,14.61 3.94,14.61
VDD_LED
  Top 0.254: D1.1 29.39,17.51 | D2.1 32.56,17.51 | D3.1 35.74,17.51
  Top 0.406: 35.74,17.51 D3.8 35.69,17.15 35.43,16.89 32.51,16.89 | 32.56,17.51 D2.8 32.51,16.89 | R7.1 R9.1 25.46,17.59 C2.1 29.34,16.89 | 29.39,17.51 D1.8 29.34,16.89 | 32.51,16.89 29.34,16.89
VMID
  Top 0.254: U2.27 46.24,13.2 46.74,12.7 C4.2 45.57,12.04 C5.1

### Text on the board
tPlace: LEFT | RIGHT | BUTTON | RGB | I2C | GP12 | POWER | HEADSET | SPEAKER | I2C | GP12
bPlace: PI | SeeedStudio / ReSpeaker / 2-Mics Pi HAT v1.0